# Altium schematic sheet Altium_Circuit_v03_CPU6502_4Plane.schdoc
size 309 x 223 mm; Symbol: Sheet-Symbol_A4; Device: Sheet-Symbol_A4; @Project Name: The20c_v03; @Page Count: 1; @Update Date: 2024-09-03; @Create Date: 2024-08-20; @Schematic Name: v03_CPU6502_4Plane; @Page No: 1; @Page Name: v03_CPU6502_4Plane; Company: OsoLabs.tech; Reviewed: OsoLabs; Version: V03; Page Size: A4; Part Number: v03_CPU6502_4Plane; Drawn: OsoLabs; @Board Name: v03_CPU6502_4Plane; @Create Time: 17:16:09; @Update Time: 15:10:16
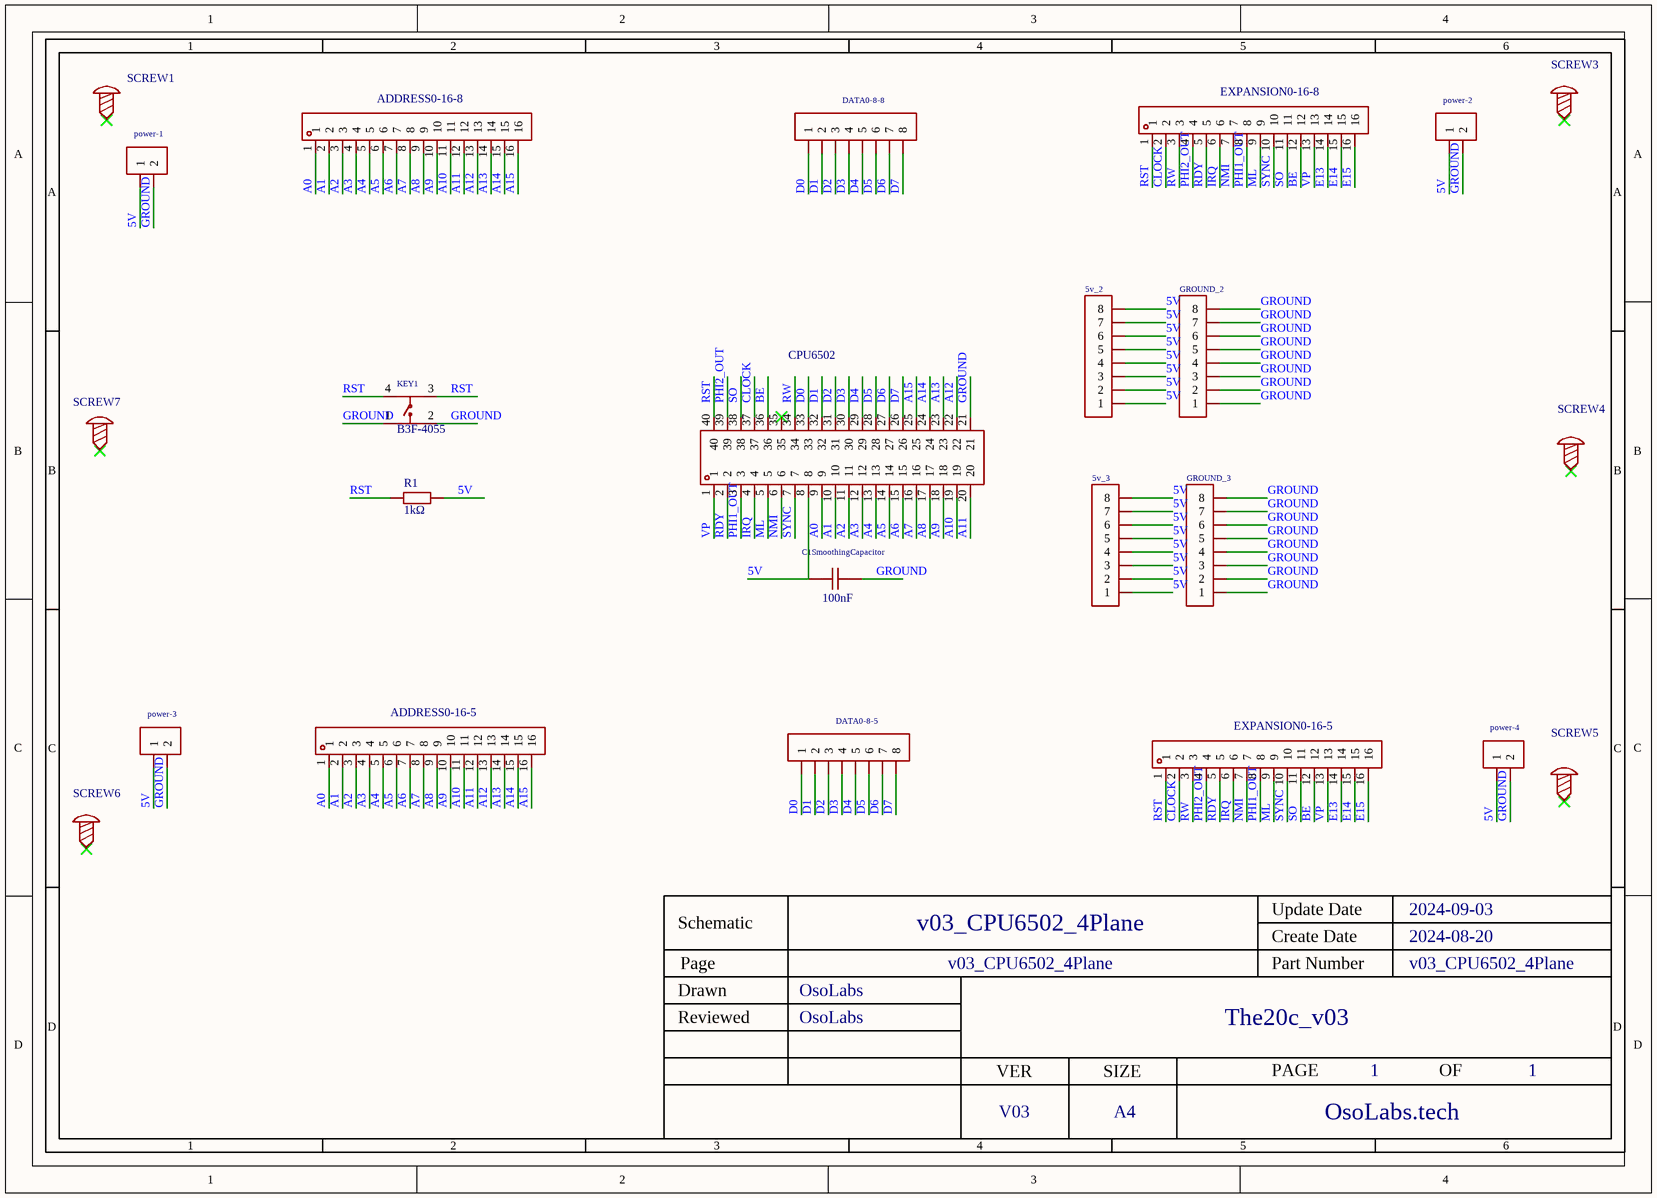
[diagram p0: Altium_Circuit_v03_CPU6502_4Plane.schdoc]

## Parts
5v_2  2.54-1*8P母环保  [HDR-TH_8P-P2.54-V-F-1]  (value not drawn)
5v_3  2.54-1*8P母环保  [HDR-TH_8P-P2.54-V-F-1]  (value not drawn)
ADDRESS0-16-5  PM254-1-16-Z-8.5  [HDR-TH_16P-P2.54-V-F-A]  (value not drawn)
ADDRESS0-16-8  PM254-1-16-Z-8.5  [HDR-TH_16P-P2.54-V-F-A]  (value not drawn)
C1SmoothingCapacitor  100nF  [CAP-TH_L5.8-W2.4-P2.54-D0.6]  (value not drawn)
CPU6502  IC座-40P  [DIP-40_L50.8-W17.8-P2.54-LS15.2-BL]  (value not drawn)
DATA0-8-5  2.54-1*8P母环保  [HDR-TH_8P-P2.54-V-F-1]  (value not drawn)
DATA0-8-8  2.54-1*8P母环保  [HDR-TH_8P-P2.54-V-F-1]  (value not drawn)
EXPANSION0-16-5  PM254-1-16-Z-8.5  [HDR-TH_16P-P2.54-V-F-A]  (value not drawn)
EXPANSION0-16-8  PM254-1-16-Z-8.5  [HDR-TH_16P-P2.54-V-F-A]  (value not drawn)
GROUND_2  2.54-1*8P母环保  [HDR-TH_8P-P2.54-V-F-1]  (value not drawn)
GROUND_3  2.54-1*8P母环保  [HDR-TH_8P-P2.54-V-F-1]  (value not drawn)
KEY1  B3F-4055  [KEY-TH_4P-L12.0-W12.0-P5.00-LS13.4-EH]  (value not drawn)
power-1  2.54-1*2P母  [HDR-TH_2P-P2.54-V-F]  (value not drawn)
power-2  2.54-1*2P母  [HDR-TH_2P-P2.54-V-F]  (value not drawn)
power-3  2.54-1*2P母  [HDR-TH_2P-P2.54-V-F]  (value not drawn)
power-4  2.54-1*2P母  [HDR-TH_2P-P2.54-V-F]  (value not drawn)
R1  1kΩ  [RES-TH_BD2.7-L6.2-P10.20-D0.4]  (value not drawn)
SCREW1  Screw-Hole-M3  [Screw-Hole-M3]  (value not drawn)
SCREW3  Screw-Hole-M3  [Screw-Hole-M3]  (value not drawn)
SCREW4  Screw-Hole-M3  [Screw-Hole-M3]  (value not drawn)
SCREW5  Screw-Hole-M3  [Screw-Hole-M3]  (value not drawn)
SCREW6  Screw-Hole-M3  [Screw-Hole-M3]  (value not drawn)
SCREW7  Screw-Hole-M3  [Screw-Hole-M3]  (value not drawn)

## Nets
5V: 5v_2.1 5v_2.2 5v_2.3 5v_2.4 5v_2.5 5v_2.6 5v_2.7 5v_2.8 5v_3.1 5v_3.2 5v_3.3 5v_3.4 5v_3.5 5v_3.6 5v_3.7 5v_3.8 C1SmoothingCapacitor.1 CPU6502.8 power-1.1 power-2.1 power-3.1 power-4.1 R1.2
A0: ADDRESS0-16-5.1 ADDRESS0-16-8.1 CPU6502.9
A1: ADDRESS0-16-5.2 ADDRESS0-16-8.2 CPU6502.10
A2: ADDRESS0-16-5.3 ADDRESS0-16-8.3 CPU6502.11
A3: ADDRESS0-16-5.4 ADDRESS0-16-8.4 CPU6502.12
A4: ADDRESS0-16-5.5 ADDRESS0-16-8.5 CPU6502.13
A5: ADDRESS0-16-5.6 ADDRESS0-16-8.6 CPU6502.14
A6: ADDRESS0-16-5.7 ADDRESS0-16-8.7 CPU6502.15
A7: ADDRESS0-16-5.8 ADDRESS0-16-8.8 CPU6502.16
A8: ADDRESS0-16-5.9 ADDRESS0-16-8.9 CPU6502.17
A9: ADDRESS0-16-5.10 ADDRESS0-16-8.10 CPU6502.18
A10: ADDRESS0-16-5.11 ADDRESS0-16-8.11 CPU6502.19
A11: ADDRESS0-16-5.12 ADDRESS0-16-8.12 CPU6502.20
A12: ADDRESS0-16-5.13 ADDRESS0-16-8.13 CPU6502.22
A13: ADDRESS0-16-5.14 ADDRESS0-16-8.14 CPU6502.23
A14: ADDRESS0-16-5.15 ADDRESS0-16-8.15 CPU6502.24
A15: ADDRESS0-16-5.16 ADDRESS0-16-8.16 CPU6502.25
BE: CPU6502.36 EXPANSION0-16-5.12 EXPANSION0-16-8.12
CLOCK: CPU6502.37 EXPANSION0-16-5.2 EXPANSION0-16-8.2
D0: CPU6502.33 DATA0-8-5.1 DATA0-8-8.1
D1: CPU6502.32 DATA0-8-5.2 DATA0-8-8.2
D2: CPU6502.31 DATA0-8-5.3 DATA0-8-8.3
D3: CPU6502.30 DATA0-8-5.4 DATA0-8-8.4
D4: CPU6502.29 DATA0-8-5.5 DATA0-8-8.5
D5: CPU6502.28 DATA0-8-5.6 DATA0-8-8.6
D6: CPU6502.27 DATA0-8-5.7 DATA0-8-8.7
D7: CPU6502.26 DATA0-8-5.8 DATA0-8-8.8
E13: EXPANSION0-16-5.14 EXPANSION0-16-8.14
E14: EXPANSION0-16-5.15 EXPANSION0-16-8.15
E15: EXPANSION0-16-5.16 EXPANSION0-16-8.16
GROUND: C1SmoothingCapacitor.2 CPU6502.21 GROUND_2.1 GROUND_2.2 GROUND_2.3 GROUND_2.4 GROUND_2.5 GROUND_2.6 GROUND_2.7 GROUND_2.8 GROUND_3.1 GROUND_3.2 GROUND_3.3 GROUND_3.4 GROUND_3.5 GROUND_3.6 GROUND_3.7 GROUND_3.8 KEY1.1 KEY1.2 power-1.2 power-2.2 power-3.2 power-4.2
IRQ: CPU6502.4 EXPANSION0-16-5.6 EXPANSION0-16-8.6
ML: CPU6502.5 EXPANSION0-16-5.9 EXPANSION0-16-8.9
NMI: CPU6502.6 EXPANSION0-16-5.7 EXPANSION0-16-8.7
PHI1_OUT: CPU6502.3 EXPANSION0-16-5.8 EXPANSION0-16-8.8
PHI2_OUT: CPU6502.39 EXPANSION0-16-5.4 EXPANSION0-16-8.4
RDY: CPU6502.2 EXPANSION0-16-5.5 EXPANSION0-16-8.5
RST: CPU6502.40 EXPANSION0-16-5.1 EXPANSION0-16-8.1 KEY1.3 KEY1.4 R1.1
RW: CPU6502.34 EXPANSION0-16-5.3 EXPANSION0-16-8.3
SO: CPU6502.38 EXPANSION0-16-5.11 EXPANSION0-16-8.11
SYNC: CPU6502.7 EXPANSION0-16-5.10 EXPANSION0-16-8.10
VP: CPU6502.1 EXPANSION0-16-5.13 EXPANSION0-16-8.13

Not connected (* = marked no-connect by the designer): CPU6502 35*; SCREW1 1*; SCREW3 1*; SCREW4 1*; SCREW5 1*; SCREW6 1*; SCREW7 1*

## Notes on the sheet
- 1
- 2
- 3
- 4
- 5
- 6
- A
- B
- C
- Schematic
- v03_CPU6502_4Plane
- Create Date
- Update Date
- 2024-09-03
- 2024-08-20
- Reviewed
- Drawn
- Page
- OsoLabs
- Part Number
- The20c_v03
- D
- VER
- SIZE
- PAGE
- OF
- V03
- A4
- OsoLabs.tech

## Library data of the parts
5v_2 5v_3 DATA0-8-5 DATA0-8-8 GROUND_2 GROUND_3 = 2.54-1*8P母环保: Holes Structure:1x8P Pitch:2.54mm Row Spacing:- Mounting Type:Straight Number of Rows:Plugin Number of Holes:8P Insulation Height:- Contact Material:- Contact Plating:-; Manufacturer: BOOMELE(博穆精密); Symbol: Header-Female-2.54_1x8; Add into BOM: yes; Holes Structure: 1x8P; Pitch: 2.54mm; Number of Holes: 8P; Device: 2.54-1*8P母环保; Supplier: LCSC; Manufacturer Part: 2.54-1*8P母环保; Supplier Part: C27438; JLCPCB Part Class: Extended Part; LCSC Part Name: 间距:2.54mm 1x8P 直插; Supplier Footprint: 插件,P=2.54mm; Datasheet: https://atta.szlcsc.com/upload/public/pdf/source/20231221/1CA800C6799ED97958773716FAA1BFFE.pdf; Convert to PCB: yes; Row Spacing: -; Mounting Type: Straight; Number of Rows: Plugin; Insulation Height: -; Contact Material: -; Contact Plating: -
ADDRESS0-16-5 ADDRESS0-16-8 EXPANSION0-16-5 EXPANSION0-16-8 = PM254-1-16-Z-8.5: Holes Structure:1x16P Pitch:2.54mm Row Spacing:- Circular Hole / Square Hole:Square Holes Mounting Type:Straight Number of Rows:Plugin Number of Holes:16P Current Rating (Max):3A Voltage Rating (Max):- Holes Direction:Top Insulation Height:8.5mm Contact M; Manufacturer: HCTL(华灿天禄); Add into BOM: yes; Holes Structure: 1x16P; Pitch: 2.54mm; Number of Holes: 16P; Current Rating (Max): 3A; Holes Direction: Top; Soldering Temperature(Max): 260℃@5S; Symbol: PM254-1-16-Z-8.5; Device: PM254-1-16-Z-8.5; LCSC Part Name: 1x16P 间距:2.54mm 直插; Supplier Part: C2897379; Manufacturer Part: PM254-1-16-Z-8.5; Supplier Footprint: 插件,P=2.54mm; JLCPCB Part Class: Extended Part; Datasheet: https://atta.szlcsc.com/upload/public/pdf/source/20230609/534BE42964C679BDE98E061007C4ABD6.pdf; Supplier: LCSC; Convert to PCB: yes; Row Spacing: -; Circular Hole / Square Hole: Square Holes; Mounting Type: Straight; Number of Rows: Plugin; Voltage Rating (Max): -; Insulation Height: 8.5mm; Contact Material: Copper Alloy; Operating Temperature Range: -40℃~+105℃
C1SmoothingCapacitor = CC1H104ZA1ED3F5P1100: Capacitance:100nF Tolerance:-20%~+80% Tolerance:-20%~+80% Voltage Rated: Lead Spacing: Temperature Coefficient: φD: Body Thickness:2.4mm; Manufacturer: Dersonic(德尔创); Add into BOM: yes; Body Thickness: 2.4mm; Symbol: CC1H104ZA1ED3F5P1100; Device: CC1H104ZA1ED3F5P1100; Supplier: LCSC; Supplier Part: C2832506; Manufacturer Part: CC1H104ZA1ED3F5P1100; Value: 100nF; JLCPCB Part Class: Extended Part; LCSC Part Name: 100nF -20%~+80% 50V; Supplier Footprint: 插件,P=2.54mm; Datasheet: https://atta.szlcsc.com/upload/public/pdf/source/20211027/619020FDD8EBC9BBFCA73A5584FA164D.pdf; Convert to PCB: yes; Tolerance: -20%~+80%
CPU6502 = IC座-40P: IC Type:DIP Pitch:2.54mm Row Spacing:15.24mm Number of Positions:40P Contact Plating:-; Manufacturer: BOOMELE(博穆精密); Symbol: ICseat-40P; Add into BOM: yes; IC Type: DIP; Pitch: 2.54mm; Number of Positions: 40P; Device: IC座-40P; LCSC Part Name: 间距2.54mm P数:40P; Supplier Part: C2332; Manufacturer Part: IC座-40P; Supplier Footprint: DIP-40; JLCPCB Part Class: Extended Part; Datasheet: https://atta.szlcsc.com/upload/public/pdf/source/20151118/1457707579760.pdf; Supplier: LCSC; Convert to PCB: yes; Row Spacing: 15.24mm; Contact Plating: -
KEY1 = B3F-4055_C84931: Circuit:SPST Actuator Style:Rectangle button Mounting Style:Straight Switch Length:12mm Switch Width:12mm Switch Height:7.3mm Contact Current:50mA Voltage Rating (DC):24V With Lamp:- Mechanical Life:-; Manufacturer: OMRON(欧姆龙); Add into BOM: yes; Circuit: SPST; Switch Length: 12mm; Switch Height: 7.3mm; Contact Current: 50mA; Voltage Rating (DC): 24V; Symbol: B3F-4055; Device: B3F-4055_C84931; Supplier: LCSC; Manufacturer Part: B3F-4055; Supplier Part: C84931; JLCPCB Part Class: Extended Part; LCSC Part Name: 12*12*7.3mm 直插 轻触开关; Supplier Footprint: 插件; Datasheet: https://atta.szlcsc.com/upload/public/pdf/source/20170810/C93157_1502335414592880008.pdf; Convert to PCB: yes; Actuator Style: Rectangle button; Mounting Style: Straight; Switch Width: 12mm; With Lamp: -; Mechanical Life: -
power-1-power-4 = 2.54-1*2P母: Holes Structure:1x2P Pitch:2.54mm Row Spacing:- Mounting Type:Straight Number of Rows:Plugin Number of Holes:2P Insulation Height:- Contact Material:- Contact Plating:-; Manufacturer: BOOMELE(博穆精密); Symbol: Header-Female-2.54_1x2; Add into BOM: yes; Holes Structure: 1x2P; Pitch: 2.54mm; Number of Holes: 2P; Device: 2.54-1*2P母; Supplier: LCSC; Manufacturer Part: 2.54-1*2P母; Supplier Part: C49661; JLCPCB Part Class: Extended Part; LCSC Part Name: 间距:2.54mm 1x2P 直插; Supplier Footprint: 插件,P=2.54mm; Datasheet: https://atta.szlcsc.com/upload/public/pdf/source/20210301/C2718488_F4427B881E42CAA8DDB0B1C12B3A522C.pdf; Convert to PCB: yes; Row Spacing: -; Mounting Type: Straight; Number of Rows: Plugin; Insulation Height: -; Contact Material: -; Contact Plating: -
R1 = CR1/4W-1K±5%-ST26: Type:Carbon Resister Resistance: Tolerance:±5% Tolerance:±5% Overload Voltage (Max):250V Power(Watts):250mW Temperature Coefficient:±350ppm/℃ Temperature Coefficient:±350ppm/℃ Operating Temperature Range:-55℃~+155℃ Operating Temperature Range:-55℃~+155℃; Manufacturer: VO(翔胜); Add into BOM: yes; Tolerance: ±5%; Overload Voltage (Max): 250V; Power(Watts): 250mW; Symbol: CR1/4W-1K±5%-ST26; Device: CR1/4W-1K±5%-ST26; LCSC Part Name: 碳膜电阻 1kΩ ±5% 250mW; Supplier Part: C2894606; Manufacturer Part: CR1/4W-1K±5%-ST26; Supplier Footprint: 插件,2.7x6.2mm; JLCPCB Part Class: Extended Part; Datasheet: https://atta.szlcsc.com/upload/public/pdf/source/20210803/C2857407_45FF53FE186CAB545115AD37303966CD.pdf; Supplier: LCSC; Convert to PCB: yes; Type: Carbon Resister; Value: 1kΩ; Temperature Coefficient: ±350ppm/℃; Operating Temperature Range: -55℃~+155℃
SCREW1 SCREW3-SCREW7 = Screw-Hole-M3: Convert to PCB: yes; Symbol: Screw-Hole; Device: Screw-Hole-M3; Add into BOM: yes; Supplier Footprint: 插件